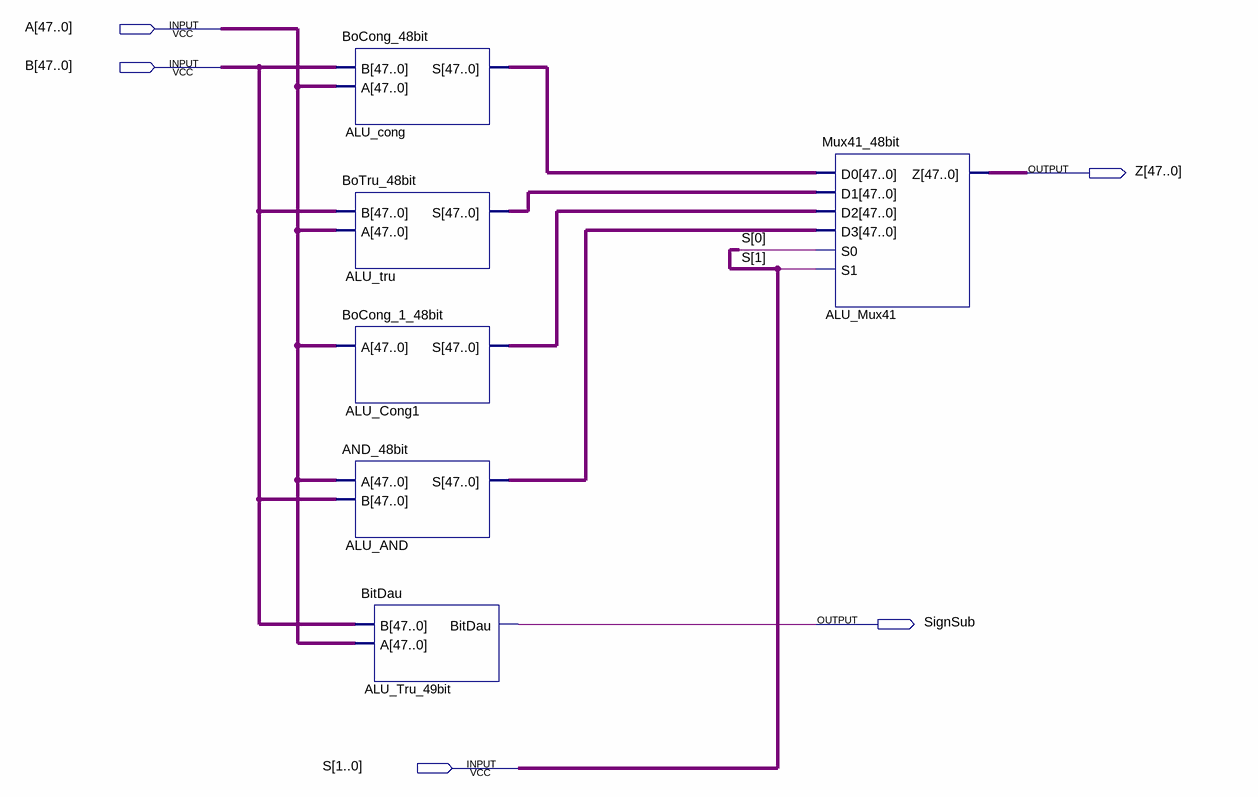
[diagram p0: schematic sheet]
// Quartus schematic ALU_48bit.bdf as structural Verilog: 6 symbols, 5 pins
module ALU_48bit (
  input  [47:0] A,
  input  [47:0] B,
  input  [1:0] S,
  output [47:0] Z,
  output SignSub
);

  wire [47:0] ALU_AND_s, ALU_Cong1_s, ALU_cong_s, ALU_tru_s;

  BoCong_48bit ALU_cong (.B(B), .A(A), .S(ALU_cong_s));
  BoTru_48bit ALU_tru (.B(B), .A(A), .S(ALU_tru_s));
  BoCong_1_48bit ALU_Cong1 (.A(A), .S(ALU_Cong1_s));
  AND_48bit ALU_AND (.A(A), .B(B), .S(ALU_AND_s));
  BitDau ALU_Tru_49bit (.B(B), .A(A), .BitDau(SignSub));
  Mux41_48bit ALU_Mux41 (
    .D0(ALU_cong_s), .D1(ALU_tru_s), .D2(ALU_Cong1_s), .D3(ALU_AND_s), .S0(S[0]), .S1(S[1]), .Z(Z));
endmodule
